# Altium schematic sheet PE4312.V03.R00.SchDoc: Atenuador Digital por Pasos
size A4; SheetNumber: 6; SheetTotal: 18
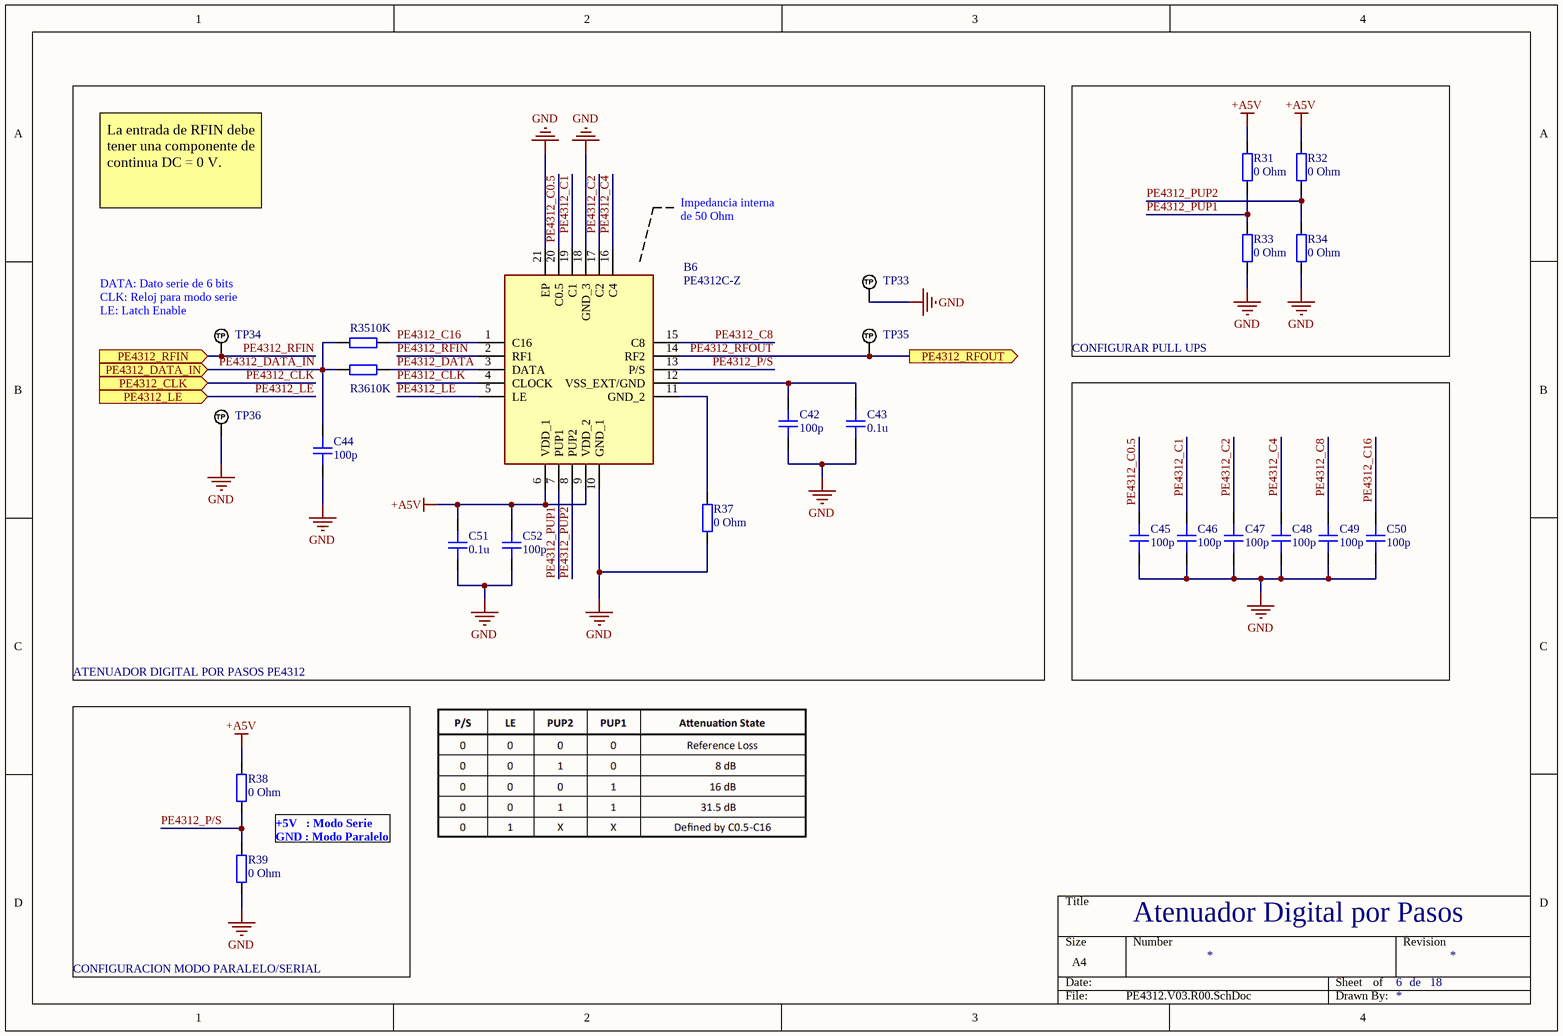
[diagram p0: PE4312.V03.R00.SchDoc]

## Parts
B6  PE4312C-Z  [QFN50P400X400X90-21N-D]
C42  100p  [CAP_0805]
C43  0.1u  [CAP_0805]
C44  100p  [CAP_0805]
C45  100p  [CAP_0805]
C46  100p  [CAP_0805]
C47  100p  [CAP_0805]
C48  100p  [CAP_0805]
C49  100p  [CAP_0805]
C50  100p  [CAP_0805]
C51  0.1u  [CAP_0805]
C52  100p  [CAP_0805]
R31  0 Ohm  [RES_0805]
R32  0 Ohm  [RES_0805]
R33  0 Ohm  [RES_0805]
R34  0 Ohm  [RES_0805]
R35  10K  [RES_0805]
R36  10K  [RES_0805]
R37  0 Ohm  [RES_0805]
R38  0 Ohm  [RES_0805]
R39  0 Ohm  [RES_0805]
TP33  TP_NOBOM  [PAD_RND_1MM]  (value not drawn)  (no BOM)
TP34  TP_NOBOM  [PAD_RND_1MM]  (value not drawn)  (no BOM)
TP35  TP_NOBOM  [PAD_RND_1MM]  (value not drawn)  (no BOM)
TP36  TP_NOBOM  [PAD_RND_1MM]  (value not drawn)  (no BOM)

## Blocks framed on the sheet
ATENUADOR DIGITAL POR PASOS PE4312: B6 C42-C44 C51 C52 R35-R37 TP33-TP36
CONFIGURAR PULL UPS: R31-R34
CONFIGURACION MODO PARALELO/SERIAL: R38 R39

## Ports
PE4312_CLK (in), PE4312_DATA_IN (in), PE4312_LE (in), PE4312_RFIN (in), PE4312_RFOUT (out)

## Nets
+A5V: B6.6(VDD_1) B6.9(VDD_2) C51.2 C52.2 R31.2 R32.2 R38.2
GND: B6.10(GND_1) B6.18(GND_3) B6.21(EP) C42.1 C43.1 C44.1 C45.1 C46.1 C47.1 C48.1 C49.1 C50.1 C51.1 C52.1 R33.1 R34.1 R37.1 R39.1 TP33.1(TP) TP36.1(TP)
PE4312_C0.5: B6.20(C0.5) C45.2
PE4312_C1: B6.19(C1) C46.2
PE4312_C2: B6.17(C2) C47.2
PE4312_C4: B6.16(C4) C48.2
PE4312_C8: B6.15(C8) C49.2
PE4312_C16: B6.1(C16) C50.2 R35.2
PE4312_CLK: B6.4(CLOCK) ; port PE4312_CLK
PE4312_DATA: B6.3(DATA) R36.2
PE4312_DATA_IN: C44.2 R35.1 R36.1 ; port PE4312_DATA_IN
PE4312_LE: B6.5(LE) ; port PE4312_LE
PE4312_P/S: B6.13(P/S) R38.1 R39.2
PE4312_PUP1: B6.7(PUP1) R31.1 R33.2
PE4312_PUP2: B6.8(PUP2) R32.1 R34.2
PE4312_RFIN: B6.2(RF1) TP34.1(TP) ; port PE4312_RFIN
PE4312_RFOUT: B6.14(RF2) TP35.1(TP) ; port PE4312_RFOUT
NetB6_11: B6.11(GND_2) R37.2
NetB6_12: B6.12(VSS_EXT/GND) C42.2 C43.2

## Notes on the sheet
- La entrada de RFIN debe tener una componente de continua DC = 0 V.
- Impedancia interna de 50 Ohm
- (near TP34) DATA: Dato serie de 6 bits
  CLK: Reloj para modo serie
  LE: Latch Enable
- +5V   : Modo Serie
  GND : Modo Paralelo
- de

## Library data of the parts
B6 = PE4312C-Z: RF ATTENUATOR 31.5DB 50OHM 20QFN; Manufacturer_Name: Peregrine Semiconductor; Geometry.Height: 0.9mm; Mouser Part Number: 81-PE4312C-Z; Mouser Price/Stock: https://www.mouser.co.uk/ProductDetail/pSemi/PE4312C-Z?qs=l7cgNqFNU1hgFbGgRtu7ww%3D%3D; Manufacturer_Part_Number: PE4312C-Z; Datasheet Link: https://www.psemi.com/pdf/datasheets/pe4312ds.pdf
C42-C52 = CAP_0805: Capacitor SMD 0805; Manufacturer: *; Manufacturer Part Number: *; Distributor Link: *; LCSC: *; Rating: *; Dielectric: *
R31-R39 = RES_0805: Resistor SMD 0805; Manufacturer: *; Manufacturer Part Number: *; Distributor Link: *; LCSC: *
TP33-TP36 = TEST_POINT_RND_1MM: Test Point Round 1mm (NO BOM)